# Altium schematic sheet Keyboard.SchDoc
size 420 x 297 mm; DocumentNumber: KeyBoard
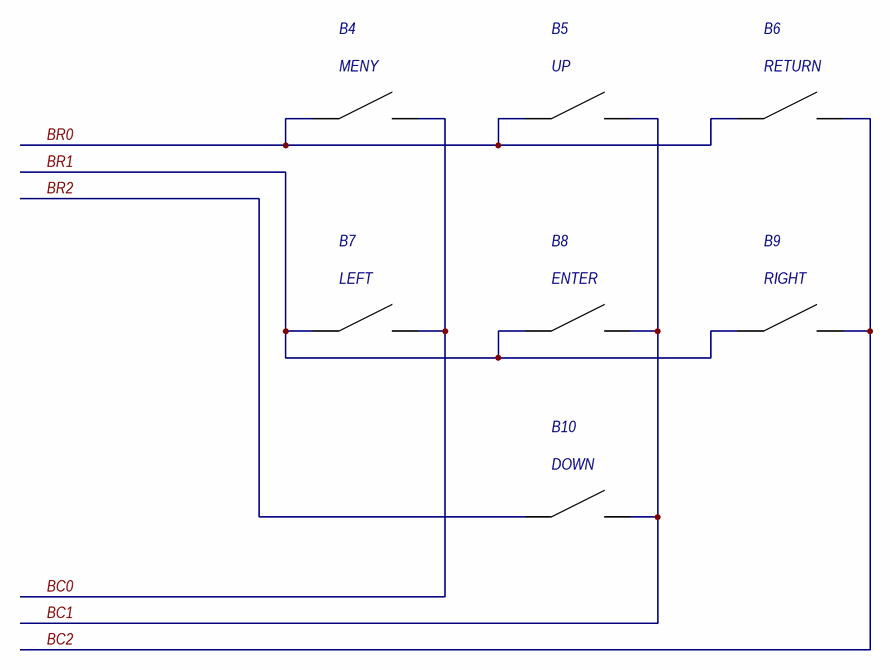
[diagram p0: Keyboard.SchDoc]

## Parts
B4  BUTTON  [BUTTON_DIP]  (value not drawn)
B5  BUTTON  [BUTTON_DIP]  (value not drawn)
B6  BUTTON  [BUTTON_DIP]  (value not drawn)
B7  BUTTON  [BUTTON_DIP]  (value not drawn)
B8  BUTTON  [BUTTON_DIP]  (value not drawn)
B9  BUTTON  [BUTTON_DIP]  (value not drawn)
B10  BUTTON  [BUTTON_DIP]  (value not drawn)

## Nets
BC0: B4.2 B7.2
BC1: B5.2 B8.2 B10.2
BC2: B6.2 B9.2
BR0: B4.1 B5.1 B6.1
BR1: B7.1 B8.1 B9.1
BR2: B10.1

## Notes on the sheet
- (near B4) MENY
- (near B5) UP
- (near B6) RETURN
- (near B7) LEFT
- (near B8) ENTER
- (near B9) RIGHT
- (near B10) DOWN
- Подп. и дата
- Инв. № дубл.
- Взам. инв. №
- Инв. № подл.
- Лист
- Изм.
- № докум.
- Подп.
- Дата
- Копировал
- Формат А3